# Altium schematic sheet MP2315SGJ-Z1_MP2315SGJ-Z.schdoc
size 124 x 101 mm
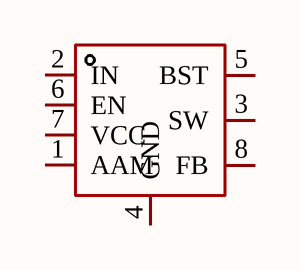
[diagram p0: MP2315SGJ-Z1_MP2315SGJ-Z.schdoc]

## Parts
U?  MP2315SGJ-Z  [TSOT-23-8_L2.9-W1.6-P0.65-LS2.8-BL]  (value not drawn)

## Nets

Not connected (* = marked no-connect by the designer): U? 1(AAM) 2(IN) 3(SW) 4(GND) 5(BST) 6(EN) 7(VCC) 8(FB)

## Library data of the parts
U? = MP2315SGJ-Z: Manufacturer: MPS(芯源); Add into BOM: yes; Function: 降压型; Output Type: 固定; Voltage - Supply: 4.5V~24V; Output Voltage: 800mV~22.8V; Output Current: 3A; Frequency - Switching: 500kHz; Synchronous Rectifier: 是; Number of Outputs: 1; Topology: 降压式; Quiescent Current: 120uA; Switch tube (built-in/external): 内置; Symbol: MP2315SGJ-Z; Device: MP2315SGJ-Z; LCSC Part Name: 3A、24V、500kHz高效同步降压转换器; Supplier Part: C3031493; Manufacturer Part: MP2315SGJ-Z; Supplier Footprint: TSOT-23-8; JLCPCB Part Class: Extended Part; Datasheet: https://atta.szlcsc.com/upload/public/pdf/source/20250306/6947E43CF096EA5EF0087E1884EF0D8F.pdf; Supplier: LCSC; Convert to PCB: yes; Operating Temperature: -40℃~+125℃